# Altium schematic sheet Thermocouples_1.SchDoc
size A; SheetNumber: 6; SheetTotal: 7
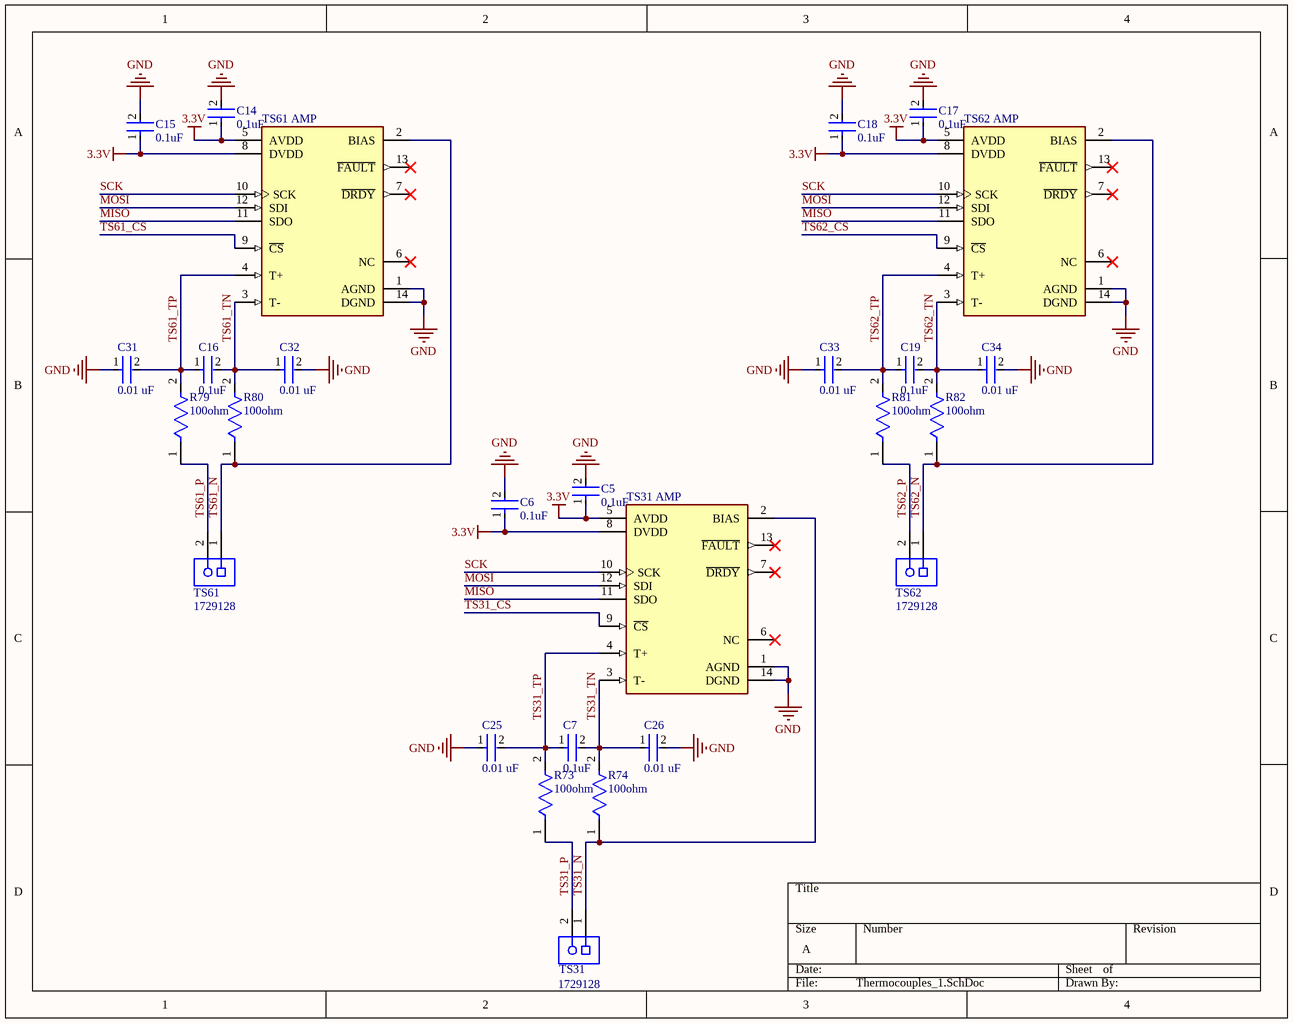
[diagram p0: Thermocouples_1.SchDoc]

## Parts
C5  0.1uF  [FP-CC0805-0_85-MFG]
C6  0.1uF  [FP-CC0805-0_85-MFG]
C7  0.1uF  [FP-CC0805-0_85-MFG]
C14  0.1uF  [FP-CC0805-0_85-MFG]
C15  0.1uF  [FP-CC0805-0_85-MFG]
C16  0.1uF  [FP-CC0805-0_85-MFG]
C17  0.1uF  [FP-CC0805-0_85-MFG]
C18  0.1uF  [FP-CC0805-0_85-MFG]
C19  0.1uF  [FP-CC0805-0_85-MFG]
C25  0.01 uF  [FP-CC0805-0_85-MFG]
C26  0.01 uF  [FP-CC0805-0_85-MFG]
C31  0.01 uF  [FP-CC0805-0_85-MFG]
C32  0.01 uF  [FP-CC0805-0_85-MFG]
C33  0.01 uF  [FP-CC0805-0_85-MFG]
C34  0.01 uF  [FP-CC0805-0_85-MFG]
R73  100ohm  [FP-RMCF0805-IPC_A]
R74  100ohm  [FP-RMCF0805-IPC_A]
R79  100ohm  [FP-RMCF0805-IPC_A]
R80  100ohm  [FP-RMCF0805-IPC_A]
R81  100ohm  [FP-RMCF0805-IPC_A]
R82  100ohm  [FP-RMCF0805-IPC_A]
TS31  1729128  [PHOE-1729128-2_V]
TS31_AMP  (no value)  [FP-U14-2-MFG]
TS61  1729128  [PHOE-1729128-2_V]
TS61_AMP  (no value)  [FP-U14-2-MFG]
TS62  1729128  [PHOE-1729128-2_V]
TS62_AMP  (no value)  [FP-U14-2-MFG]

## Nets
3.3V: C5.1 C6.1 C14.1 C15.1 C17.1 C18.1 TS31_AMP.5(AVDD) TS31_AMP.8(DVDD) TS61_AMP.5(AVDD) TS61_AMP.8(DVDD) TS62_AMP.5(AVDD) TS62_AMP.8(DVDD)
GND: C5.2 C6.2 C14.2 C15.2 C17.2 C18.2 C25.1 C26.2 C31.1 C32.2 C33.1 C34.2 TS31_AMP.1(AGND) TS31_AMP.14(DGND) TS61_AMP.1(AGND) TS61_AMP.14(DGND) TS62_AMP.1(AGND) TS62_AMP.14(DGND)
MISO: TS31_AMP.11(SDO) TS61_AMP.11(SDO) TS62_AMP.11(SDO)
MOSI: TS31_AMP.12(SDI) TS61_AMP.12(SDI) TS62_AMP.12(SDI)
SCK: TS31_AMP.10(SCK) TS61_AMP.10(SCK) TS62_AMP.10(SCK)
TS31_CS: TS31_AMP.9(~{CS})
TS31_N: R74.1 TS31.1 TS31_AMP.2(BIAS)
TS31_P: R73.1 TS31.2
TS31_TN: C7.2 C26.1 R74.2 TS31_AMP.3(T-)
TS31_TP: C7.1 C25.2 R73.2 TS31_AMP.4(T+)
TS61_CS: TS61_AMP.9(~{CS})
TS61_N: R80.1 TS61.1 TS61_AMP.2(BIAS)
TS61_P: R79.1 TS61.2
TS61_TN: C16.2 C32.1 R80.2 TS61_AMP.3(T-)
TS61_TP: C16.1 C31.2 R79.2 TS61_AMP.4(T+)
TS62_CS: TS62_AMP.9(~{CS})
TS62_N: R82.1 TS62.1 TS62_AMP.2(BIAS)
TS62_P: R81.1 TS62.2
TS62_TN: C19.2 C34.1 R82.2 TS62_AMP.3(T-)
TS62_TP: C19.1 C33.2 R81.2 TS62_AMP.4(T+)

Not connected (* = marked no-connect by the designer): TS31_AMP 6(NC)* 7(~{DRDY})* 13(~{FAULT})*; TS61_AMP 6(NC)* 7(~{DRDY})* 13(~{FAULT})*; TS62_AMP 6(NC)* 7(~{DRDY})* 13(~{FAULT})*

## Library data of the parts
C5-C7 C14-C19 = CMP-2100-03606-3: CAP CER 0.1UF 50V X7R 0805; Manufacturer Part Number: CC0805KRX7R9BB104; Manufacturer: Yageo; Tolerance: 0.1; Capacitance: 100 nF; Value: 100 nF; Material: Ceramic; Device Class L1: Passive Components; ComponentLink2Description: Datasheet; Package: CC0805-0.85; Digikey Description: CAP CER 0.1UF 50V X7R 0805; Device Class L3: Ceramic Capacitors; Temperature: -30°C to +85°C; Temperature Characteristic: X7R; Voltage Rating: 50 V; Height: 0.95mm; RoHS: TRUE; Ipc Land Pattern Name: CAPC200125X85; Device Class L2: Capacitors; Category: Cap; Temperature Range Low: -30°C; Temperature Range High: +85°C; Mouser Description: Multilayer Ceramic Capacitors MLCC - SMD/SMT 100nF 50V X7R 10%; Footprint Url: http://www.yageo.com/exep/pages/download/literatures/UPY-C_GEN_24.pdf; Automotive: No; Octopart: https://octopart.com/cc0805krx7r9bb104-yageo-192993; Lead Free: Yes; ComponentLink2URL: http://www.yageo.com/documents/recent/UPY-GPHC_Y5V_6.3V-to-50V_8.pdf
C25 C26 C31-C34 = CMP-1036-03842-3: CAP CER 10000PF 50V X7R 0805; Manufacturer: Yageo; Manufacturer Part Number: CC0805KRX7R9BB103; Capacitance: 10 nF; Material: Ceramic; Value: 10 nF; Tolerance: 0.1; Footprint Url: http://www.yageo.com/exep/pages/download/literatures/UPY-C_GEN_24.pdf; Temperature Characteristic: X7R; ComponentLink2Description: Datasheet; Lead Free: Yes; Height: 0.95mm; Temperature Range High: +85°C; Automotive: No; Octopart: https://octopart.com/cc0805krx7r9bb103-yageo-192989; Device Class L1: Passive Components; Mouser Description: Multilayer Ceramic Capacitors MLCC - SMD/SMT 10nF 50V X7R 10%; Temperature: -30°C to +85°C; Device Class L2: Capacitors; Ipc Land Pattern Name: CAPC200125X85; Device Class L3: Ceramic Capacitors; Temperature Range Low: -30°C; RoHS: TRUE; Voltage Rating: 50 V; Package: CC0805-0.85; Category: Cap; ComponentLink2URL: http://www.yageo.com/documents/recent/UPY-GPHC_Y5V_6.3V-to-50V_8.pdf; Digikey Description: CAP CER 10000PF 50V X7R 0805
R73 R74 R79-R82 = CMP-26527-001731-1: 100Ω ±1% 0.125W 0805 Thick Film Chip Resistor AEC-Q200 compliant; Power Rating: 250mW; Temperature Coefficient: 100ppm/°C; Resistance: 100R; Max Power Dissipation: 125mW; Radiation Hardening: No; RoHS Compliant: Yes; Case Code (Imperial): 0805; Depth: 1.25mm; Length: 2mm; Min Operating Temperature: -55°C; Series: RMCF; Packaging: Tape and Reel; Features: Automotive AEC-Q200; Height: 0.026inch; Size Code: 0805; Tolerance: 1%; Number of Terminations: 2; Max Operating Temperature: 155°C; Case/Package: 0805; Width: 0.049inch; Contact Plating: Tin; Resistor Type: Thick Film; Construction: Rectangular; Lead Free: Lead Free; Military Standard: Not; Case Code (Metric): 2012; Mount: Surface Mount
TS31 TS61 TS62 = CMP-2000-05815-1: PCB Terminal Block, 13.5 A, 400 V, 2-Pin THD, RoHS, Bulk; Manufacturer: Phoenix Contact; Package Version: 03/2015; No. of Rows: 1; Pitch: 5.08mm; No. of Positions: 2; Voltage Rating: 400V; Current Rating: 13500mA; Manufacturer URL: http://www.phoenixcontact.com/; Datasheet URL: https://datasheet.ciiva.com/16046/1729128-16046181.pdf; RoHS: TRUE; Package URL: https://www.phoenixcontact.com/online/portal/pi/pxc/product_detail_page/!ut/p/b1/3VdJjqNKFDxLH8AFycySyWY2ozFsEPOMMQaDOX1XedGL_1Vdm5YXJleknhSKeBkvI6EA8ncAo3AYoDhBQGco6KN7VURTdemj9us_IEKEZo_YHiPAEWEFmDGOHMORkqKYCORBZxgL7ZoaZYcbFFUZ3fqxSY6GOuxydWUuHqz1ynmMFygu583Bob0Ewr6Sd_l-5m-kAueHiB0jpRwZwe58wwtkpxtMYd_LmGcDRU02dRNEyWt6Y2ti5pSyJ_reIkzIulrqApdnbT11V5jnCKbYNCvhEM1MCpPByat_X379-iThf08CI5GfOPqfBeS3BRoBOdD55AKVv0iLwCMq-2BrzXWSGRH7pUGD9uwXQjiph3xL0DKQwdGa0JImiIOmBNOestqgwTHSSs2oOep-78apyXQBvNi8ZLaFjvjWvcaUEBu0MC6Wbe-d6mB0FAebo2lUWinqYaZs5DAYzV0RP9yitUjnGJ0iI9xhZkT42OCQNUJJhkgWINNQLP2JFP6OpMg3JCVg70jqHT0lvKOnhHf0lPuOnnLf0VPuWx6_dxwUIvwk5WMkT0kLL1mh61l2yZVSzG3pYV_bqo-mj6uMKwKwdnnW8Jh5RTOJzMOA5c-eJDaZQw4mTMPH02PvS_ZAqNVjVTo2WyYLkwH_KU1mmmG5kjRhDqPXLwwVHvVOjCM60-fpXvTDfMGW1PVFVS1r4e4yVDk4ZdNbkUHvqPqQSeian4UD39fNKmachqdJ1NJbyk8rXT9mXTvPk3oE5meulKGgiruPJek-4I9hTT6G8ZLOyRSm2RRVbThERQad5OS28hdt4YW4vG0stgYYzsWsK4_7y6DZMjJSCqri1kyiZR5vD7pwIrNR7QwPHTcLTI5qT7eRlpHrdGiupYlqQDJ7zy_CND8fWWBoLRXxk1RVcXiBQwbTD4Xi7KL-FuO94t9xaqweXzH; PartNumber: 1729128; Package Description: 2-Pin Through Hole Device, Body 8.1 x 10.16 mm, Pitch 5.08 mm; Datasheet Version: 12/2013; Mounting Technology: ThroughHole; Orientation: Horizontal; Package Reference: 1729128-2; Packing: Bulk
TS31_AMP TS61_AMP TS62_AMP = CMP-05687-000002-1: IC CONV THERMOCOUPLE 14TSSOP; Manufacturer Part Number: MAX31856MUD+T; Manufacturer: Maxim Electronics; Sensor Output: SPI; Max Junction Temp: +150°C; Min Supply Voltage: 3V; Standoff Height: 0.05mm; Max Supply Voltage: 3.6V; Nominal Supply Current: 1.2mA; Automotive: No; Temperature Range Low: -55°C; Device Class L3: Sensor and Detector Interfaces; Temperature Range High: +125°C; Package: U14-2; Sensor Type String: Thermocouple; Ipc Land Pattern Name: SOP65P640X110-14; Temperature: -55°C to +125°C; Device Class L1: Integrated Circuits (ICs); ComponentLink2Description: Datasheet; Digikey Description: IC CONV THERMOCOUPLE 14TSSOP; ComponentLink2URL: https://datasheets.maximintegrated.com/en/ds/MAX31856.pdf; RoHS: TRUE; Device Class L2: Interface ICs; Octopart: https://octopart.com/max31856mud%2Bt-maxim+integrated-51261112; Interface: SPI; Lead Free: Yes; Sensor Input: Thermocouple; Footprint Url: https://pdfserv.maximintegrated.com/land_patterns/90-0113.PDF; Height: 1.1mm; Category: IC